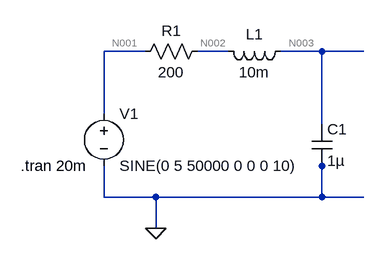
[diagram p0: schematic Objective 3.2.asc]
Objective 3.2.asc, the LTspice schematic file:
Version 4
SHEET 1 880 680
WIRE 96 80 32 80
WIRE 224 80 176 80
WIRE 368 80 304 80
WIRE 432 80 368 80
WIRE 32 176 32 80
WIRE 368 192 368 80
WIRE 368 256 368 240
WIRE 32 304 32 256
WIRE 112 304 32 304
WIRE 368 304 368 256
WIRE 368 304 112 304
WIRE 432 304 368 304
WIRE 112 352 112 304
FLAG 112 352 0
SYMBOL res 192 64 R90
WINDOW 0 0 56 VBottom 2
WINDOW 3 32 56 VTop 2
SYMATTR InstName R1
SYMATTR Value 200
SYMBOL ind 320 64 R90
WINDOW 0 5 56 VBottom 2
WINDOW 3 32 56 VTop 2
SYMATTR InstName L1
SYMATTR Value 10m
SYMBOL cap 352 192 R0
SYMATTR InstName C1
SYMATTR Value 1µ
SYMBOL voltage 32 160 R0
WINDOW 123 24 124 Left 2
WINDOW 39 0 0 Left 0
SYMATTR InstName V1
SYMATTR Value SINE(0 5 50000 0 0 0 10)
TEXT -96 256 Left 2 !.tran 20m

The netlist it stands for:
* Objective 3.2.asc
R1 N002 N001 200
L1 N003 N002 10m
C1 N003 0 1µ
V1 N001 0 SINE(0 5 50000 0 0 0 10)
.tran 20m
.backanno
.end

* Results of the author's LTspice run, read from the files saved beside the schematic
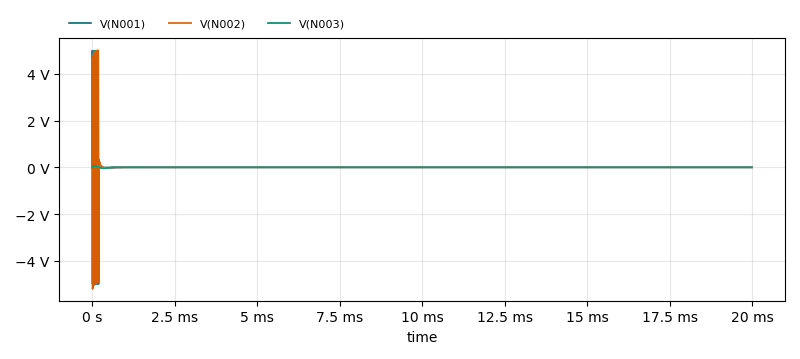
[diagram p1: Transient Analysis of Objective 3.2.asc, plotted from the saved traces]
* Transient Analysis, 1 run:
*   V(N001): min -5 V, max 4.998 V, average -41.65 µV, rms 357.4 mV, last 0 V
*   V(N002): min -5.204 V, max 5.012 V, average -83.62 µV, rms 350.8 mV, last 0 V
*   V(N003): min -39.32 mV, max 62.3 mV, average -37.37 µV, rms 6.193 mV, last 0 V